# EAGLE design regulator (EAGLE 7.4.0)
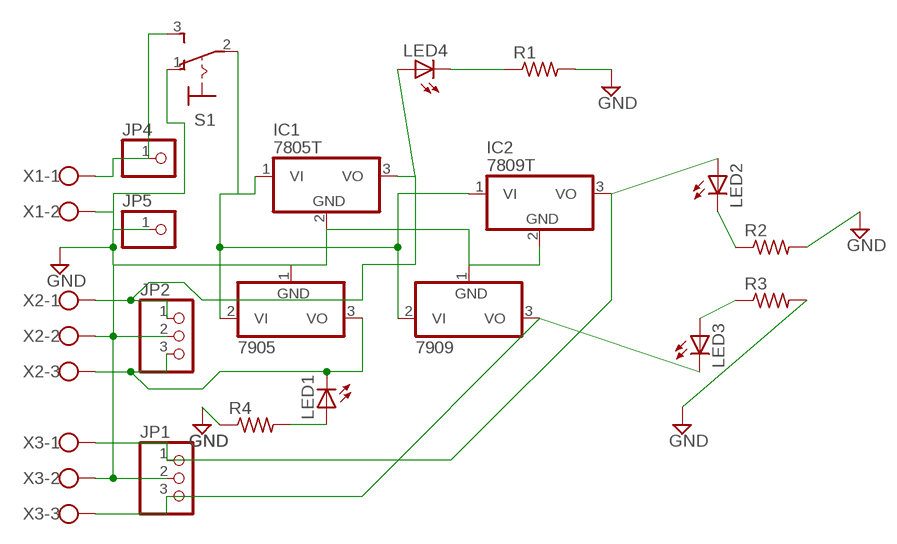
[diagram p0: schematic, sheet 1]

## Parts
7905  7905T  [TO220H]
7909  7905T  [TO220H]
IC1  7805T  [TO220H]
IC2  7809T  7805T  [TO220H]
JP1  PINHD-1X3CB  [1X03-CLEANBIG]
JP2  PINHD-1X3CB  [1X03-CLEANBIG]
JP4  PINHD-1X1CB  [1X01-CLEANBIG]
JP5  PINHD-1X1CB  [1X01-CLEANBIG]
LED1  LED3MM  [LED3MM]
LED2  LED3MM  [LED3MM]
LED3  LED3MM  [LED3MM]
LED4  LED3MM  [LED3MM]
R1  R-US_0309/10  [0309/10]
R2  R-US_0309/10  [0309/10]
R3  R-US_0309/10  [0309/10]
R4  R-US_0309/10  [0309/10]
S1  320-916  [320-916]
X1  W237-102  [W237-102]
X2  W237-103  [W237-103]
X3  W237-103  [W237-103]

## Nets
GND: 7905.1(GND) 7909.1(GND) IC1.2(GND) IC2.2(GND) JP1.2 JP2.2 JP5.1 R1.2 R2.2 R3.2 R4.1 S1.1(O) X1.2 X2.2 X3.2
N$1: 7905.2(VI) 7909.2(VI) IC1.1(VI) IC2.1(VI) S1.2(P)
N$2: JP4.1 S1.3(S) X1.1
N$3: LED4.K(C) R1.1
N$4: LED2.K(C) R2.1
N$5: LED1.A R4.2
N$6: 7905.3(VO) JP2.3 LED1.K(C) X2.3
N$7: IC2.3(VO) JP1.1 LED2.A X3.1
N$8: LED3.A R3.1
N$9: 7909.3(VO) JP1.3 LED3.K(C) X3.3
N$10: IC1.3(VO) JP2.1 LED4.A X2.1

## Library data of the parts
7905 7909 = linear:79*: Negative VOLTAGE REGULATOR
IC1 IC2 = adafruit:78*: Positive VOLTAGE REGULATOR Added bigger pads to the TO-92 package
JP1 JP2 = adafruit:PINHD-1X3: PIN HEADER
JP4 JP5 = adafruit:PINHD-1X1: Pin header 1x1 for 0.1" spacing With round pins
LED1-LED4 = adafruit:LED: LED OSRAM: - CHIPLED LG R971, LG N971, LY N971, LG Q971, LY Q971, LO R971, LY R971 LH N974, LH R974 LS Q976, LO Q976, LY Q976 LO Q996 - Hyper CHIPLED LW Q18S LB Q993, LB Q99A, LB R99A - SideLED LS A670, LO A670, LY A670, LG A670, LP A670 LB A673, LV A673, LT A673, LW A673 LH A674 LY A675 LS A676, LA A676, LO A676, LY A676, LW A676 LS A679, LY A679, LG A679 - Hyper Micro SIDELED® LS Y876, LA Y876, LO Y876, LY Y876 LT Y87S - SmartLED LW L88C, LW L88S LB L89C, LB L89S, LG L890 LS L89K, LO L89K, LY L89K LS L896, LA L896, LO L896, LY L896 - TOPLED LS T670, LO T670, LY T670, LG T670, LP T670 LSG T670, LSP T670, LSY T670, LOP T670, LYG T670 LG T671, LOG T671, LSG T671 LB T673, LV T673, LT T673, LW T673 LH T674 LS T676, LA T676, LO T676, LY T676, LB T676, LH T676, LSB T676, LW T676 LB T67C, LV T67C, LT T67C, LS T67K, LO T67K, LY T67K, LW E67C LS E67B, LA E67B, LO E67B, LY E67B, LB E67C, LV E67C, LT E67C LW T67C LS T679, LY T679, LG T679 LS T770, LO T770, LY T770, LG T770, LP T770 LB T773, LV T773, LT T773, LW T773 LH T774 LS E675, LA E675, LY E675, LS T675 LS T776, LA T776, LO T776, LY T776, LB T776 LHGB T686 LT T68C, LB T68C - Hyper Mini TOPLED® LB M676 - Mini TOPLED Santana® LG M470 LS M47K, LO M47K, LY M47K Source: http://www.osram.convergy.de/
R1-R4 = adafruit:R-US_: RESISTOR, American symbol
S1 = switch:320-916: TOGGLE SWITCH distributor RS Components
X1 = con-wago-500:W237-102: WAGO SCREW CLAMP; MPN: 237-102; OC_FARNELL: unknown; OC_NEWARK: 70K9898
X2 X3 = con-wago-500:W237-103: WAGO SCREW CLAMP; MPN: 237-103; OC_FARNELL: unknown; OC_NEWARK: 18M7116

## Board
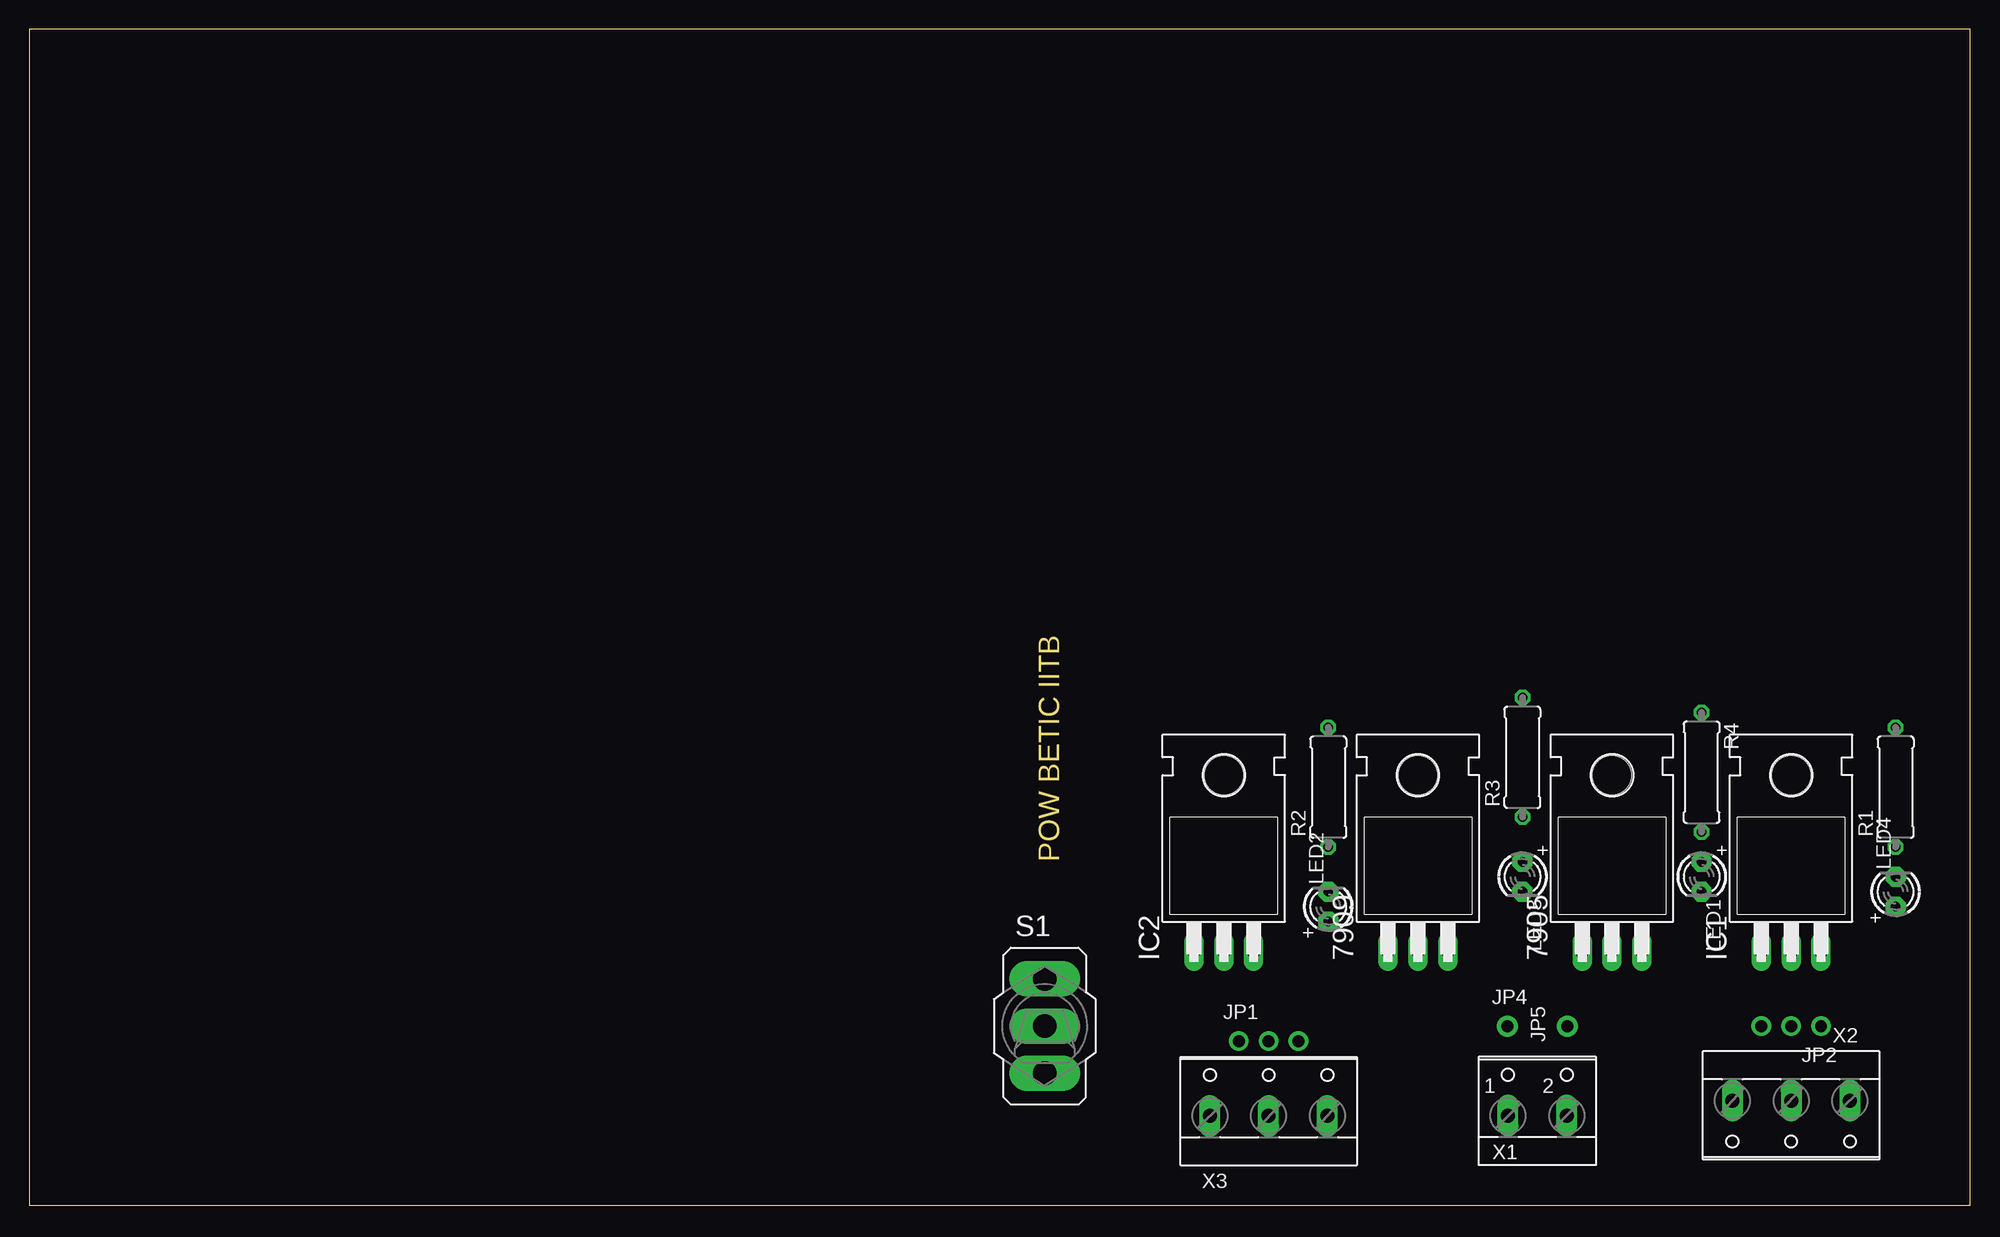
[diagram p1: board, top side]
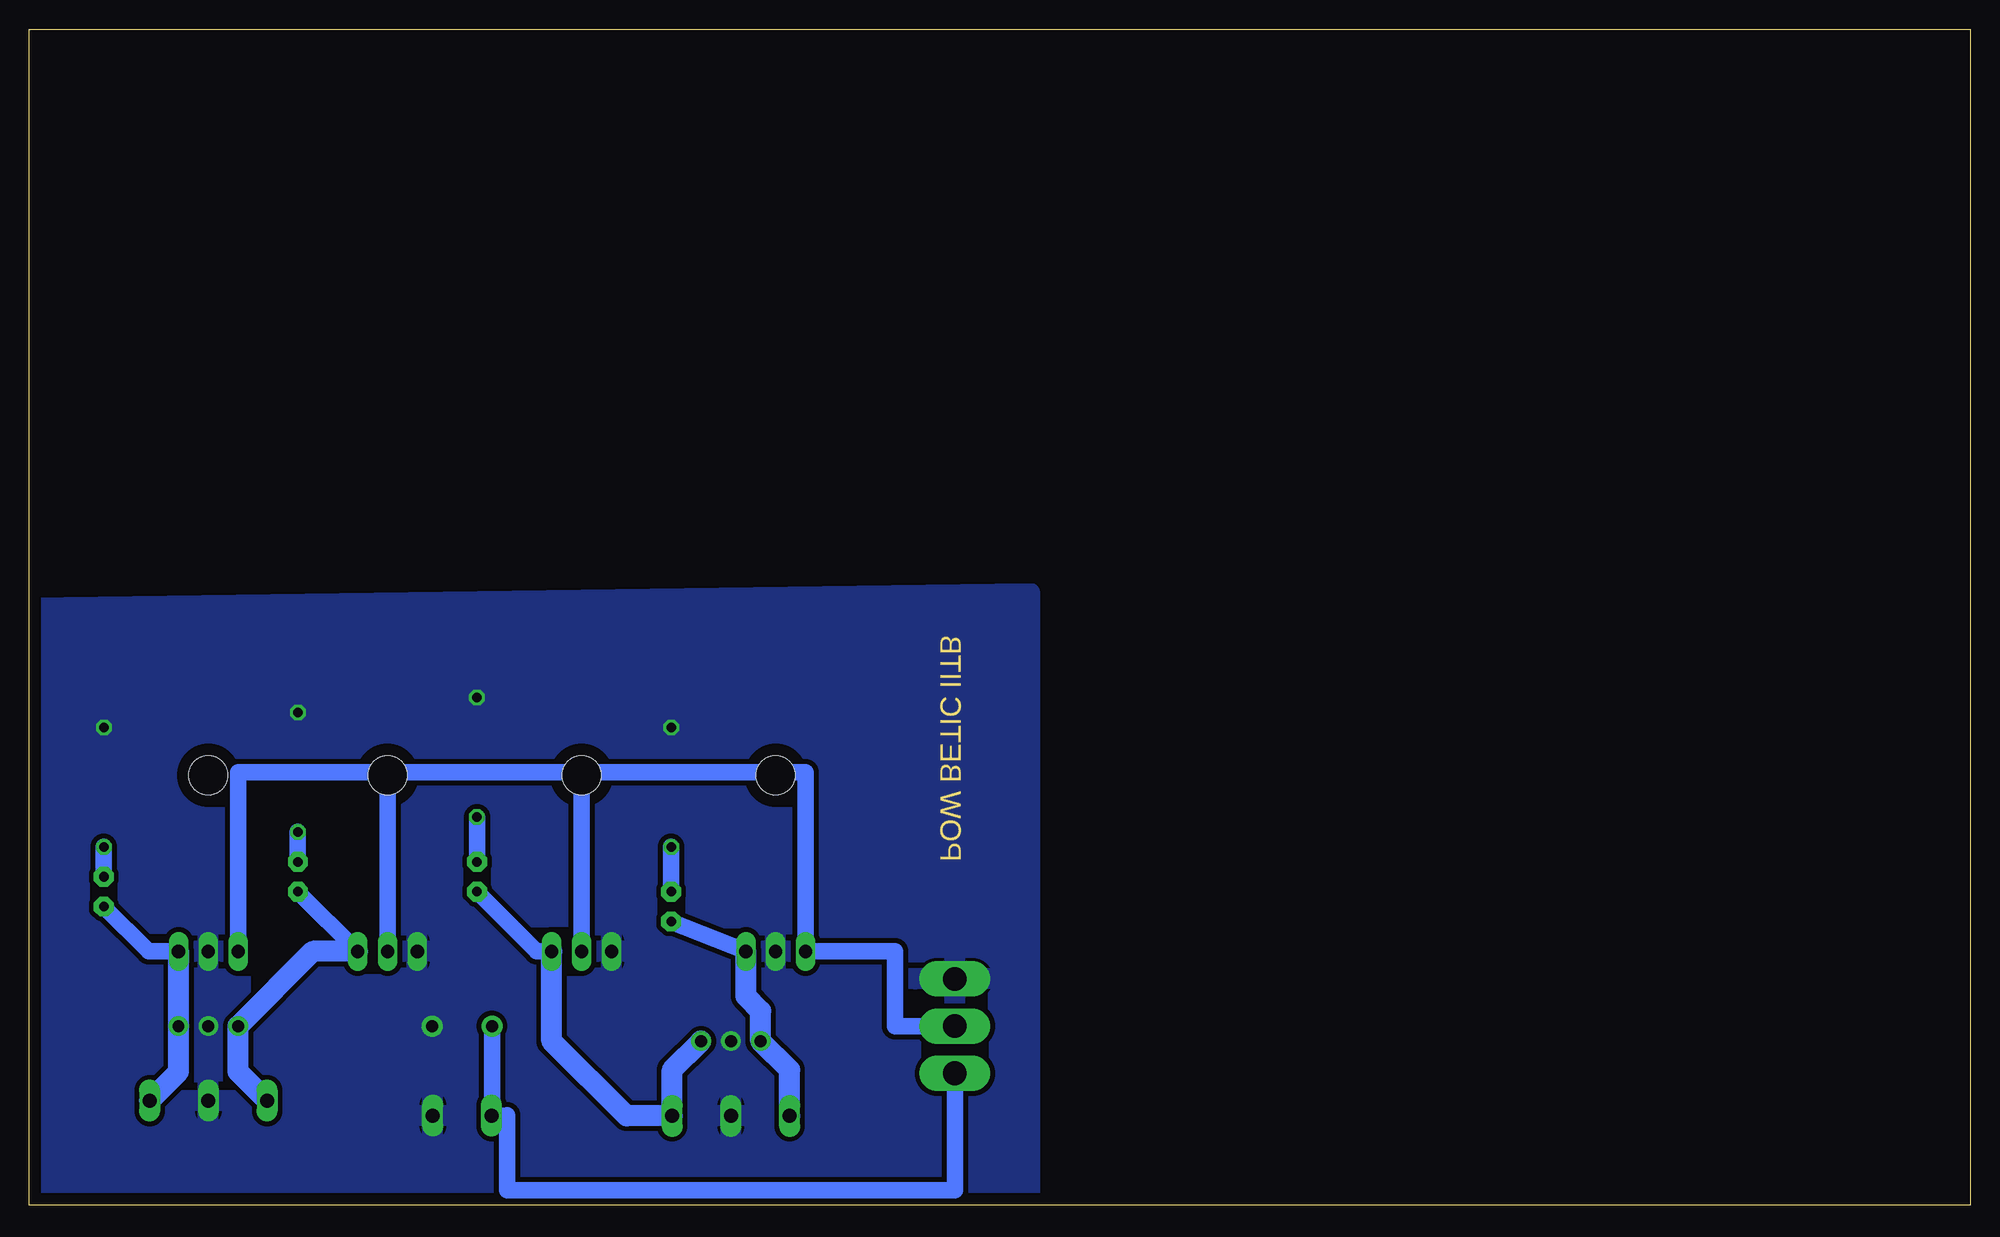
[diagram p2: board, bottom side, seen from below]

Size 165.08 x 100 mm. Coordinates in mm from the lower left corner, seen from the top.
Outline: 0,0 165.08,0 165.08,100 0,100 0,0
Copper layers (1*16): Top 0.035mm / dielectric 1.5mm / Bottom 0.035mm
Design rules "default *": minimum track width 10mil, minimum drill 24mil, track to track 16mil, track to pad 16mil, pad to pad 16mil, via to via 16mil, smd to smd 16mil, copper to edge 40mil, drill to drill 8mil, minimum pad ring 10mil, minimum via ring 8mil, stop-mask expansion 4mil, vias tented up to drill 0mil, thermal gap 10mil

### Footprints (pad centres in the part's own frame; a part is rotated, then mirrored left to right if it is on the bottom)
TO220H = drill 1.118 long: 1 -2.54,-10.16; 2 0,-10.16; 3 2.54,-10.16 | hole 3.302: 0,4.826
1X03-CLEANBIG = drill 1.016 pad 1.676: 1 -2.54,0; 2 0,0; 3 2.54,0
1X01-CLEANBIG = drill 1.016 pad 1.778: 1 0,0
LED3MM = drill 0.813 pad 1.676 octagon: A -1.27,0; K 1.27,0
0309/10 = drill 0.813 octagon: 1 -5.08,0; 2 5.08,0
320-916 = drill 2.007 long: 1 0,4.013; 2 0,0; 3 0,-4.013
W237-102 = drill 1.194 long: 1 -2.5,-1.27; 2 2.5,-1.27
W237-103 = drill 1.194 long: 1 -5,-1.29; 2 0,-1.29; 3 5,-1.29

### Placement (x,y rotation side)
7905  134.62,31.75 0 top
7909  118.11,31.75 0 top
IC1  149.86,31.75 0 top
IC2  101.6,31.75 0 top
JP1  105.41,13.97 0 top
JP2  149.86,15.24 180 top
JP4  125.73,15.24 0 top
JP5  130.81,15.24 90 top
LED1  142.24,27.94 270 top
LED2  110.49,25.4 90 top
LED3  127,27.94 270 top
LED4  158.75,26.67 90 top
R1  158.75,35.56 90 top
R2  110.49,35.56 90 top
R3  127,38.1 90 top
R4  142.24,36.83 270 top
S1  86.36,15.24 0 top
X1  128.27,8.89 0 top
X2  149.86,7.62 180 top
X3  105.41,8.89 0 top

### Tracks (layer width: path | path; a pad name or v marks a point on that pad's centre or on a via)
GND
  pour Bottom: 80.01,0 165.1,0 165.1,50.8 80.01,52.07
N$1
  Bottom 1.422: 118.11,36.83 99.06,36.83 IC2.1 91.44,21.59 91.44,15.24 S1.2 | 118.11,36.83 134.62,36.83 | 134.62,36.83 147.32,36.83 IC1.1 | 7909.2 118.11,36.83 | 7905.2 134.62,36.83
N$2
  Bottom 1.422: X1.1 124.46,7.66 | S1.3 86.36,1.27 124.46,1.27 124.46,7.62 X1.1 | JP4.1 125.73,7.62 X1.1
N$3
  Bottom 1.422: LED4.K R1.1
N$4
  Bottom 1.422: LED2.K R2.1
N$5
  Bottom 1.422: LED1.A R4.2
N$6
  Bottom 1.422: LED1.K 7905.3
  Bottom 1.778: X2.3 147.32,11.37 JP2.3 140.97,21.59 7905.3
N$7
  Bottom 1.422: LED2.A IC2.3
  Bottom 1.778: X3.1 100.41,11.51 JP1.1 102.87,16.51 104.14,17.78 IC2.3
N$8
  Bottom 1.422: R3.1 LED3.A
N$9
  Bottom 1.422: LED3.K 121.92,21.59 7909.3
  Bottom 1.778: 7909.3 120.65,13.97 114.28,7.6 X3.3 110.41,11.51 JP1.3
N$10
  Bottom 1.422: LED4.A 154.94,21.59 IC1.3
  Bottom 1.778: X2.1 152.4,11.37 JP2.1 IC1.3

### Text on the board
Dimension: POW BETIC IITB